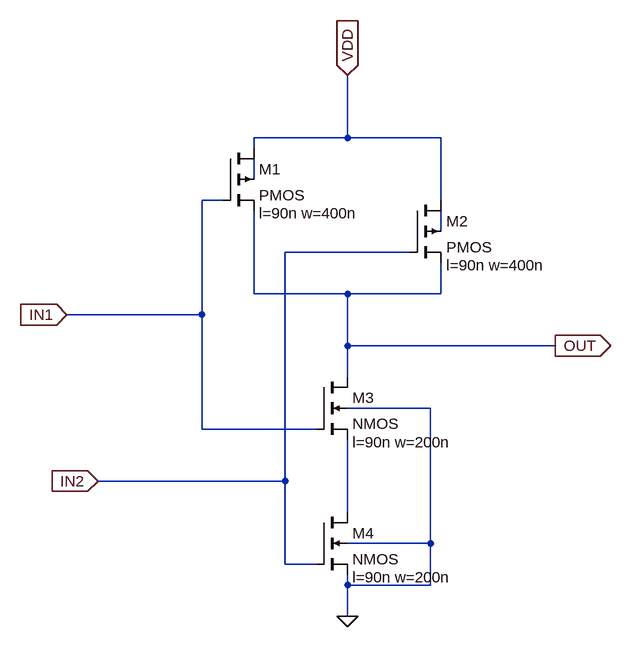
[diagram p0: schematic nand.asc]
nand.asc, the LTspice schematic file:
Version 4
SHEET 1 1232 788
WIRE 448 -192 448 -288
WIRE 448 -192 304 -192
WIRE 592 -192 448 -192
WIRE 304 -176 304 -192
WIRE 304 -128 304 -160
WIRE 256 -96 224 -96
WIRE 592 -96 592 -192
WIRE 592 -48 592 -80
WIRE 544 -16 352 -16
WIRE 304 48 304 -80
WIRE 448 48 304 48
WIRE 592 48 592 0
WIRE 592 48 448 48
WIRE 224 80 224 -96
WIRE 224 80 16 80
WIRE 448 128 448 48
WIRE 768 128 448 128
WIRE 448 176 448 128
WIRE 576 224 448 224
WIRE 224 256 224 80
WIRE 400 256 224 256
WIRE 352 336 352 -16
WIRE 352 336 64 336
WIRE 448 384 448 272
WIRE 576 432 576 224
WIRE 576 432 448 432
WIRE 352 464 352 336
WIRE 400 464 352 464
WIRE 448 496 448 480
WIRE 576 496 576 432
WIRE 576 496 448 496
WIRE 448 544 448 496
FLAG 448 544 0
FLAG 768 128 OUT
IOPIN 768 128 Out
FLAG 448 -288 VDD
IOPIN 448 -288 In
FLAG 16 80 IN1
IOPIN 16 80 In
FLAG 64 336 IN2
IOPIN 64 336 In
SYMBOL pmos4 256 -176 R0
WINDOW 123 56 100 Left 2
SYMATTR Value2 l=90n w=400n
SYMATTR InstName M1
SYMBOL pmos4 544 -96 R0
WINDOW 123 56 100 Left 2
SYMATTR Value2 l=90n w=400n
SYMATTR InstName M2
SYMBOL nmos4 400 176 R0
WINDOW 123 56 100 Left 2
SYMATTR Value2 l=90n w=200n
SYMATTR InstName M3
SYMBOL nmos4 400 384 R0
WINDOW 123 56 100 Left 2
SYMATTR Value2 l=90n w=200n
SYMATTR InstName M4

The netlist it stands for:
* nand.asc
M1 VDD IN1 OUT N001 PMOS l=90n w=400n
M2 VDD IN2 OUT N002 PMOS l=90n w=400n
M3 OUT IN1 N003 0 NMOS l=90n w=200n
M4 N003 IN2 0 0 NMOS l=90n w=200n
.model NMOS NMOS
.model PMOS PMOS
.lib standard.mos
.backanno
.end